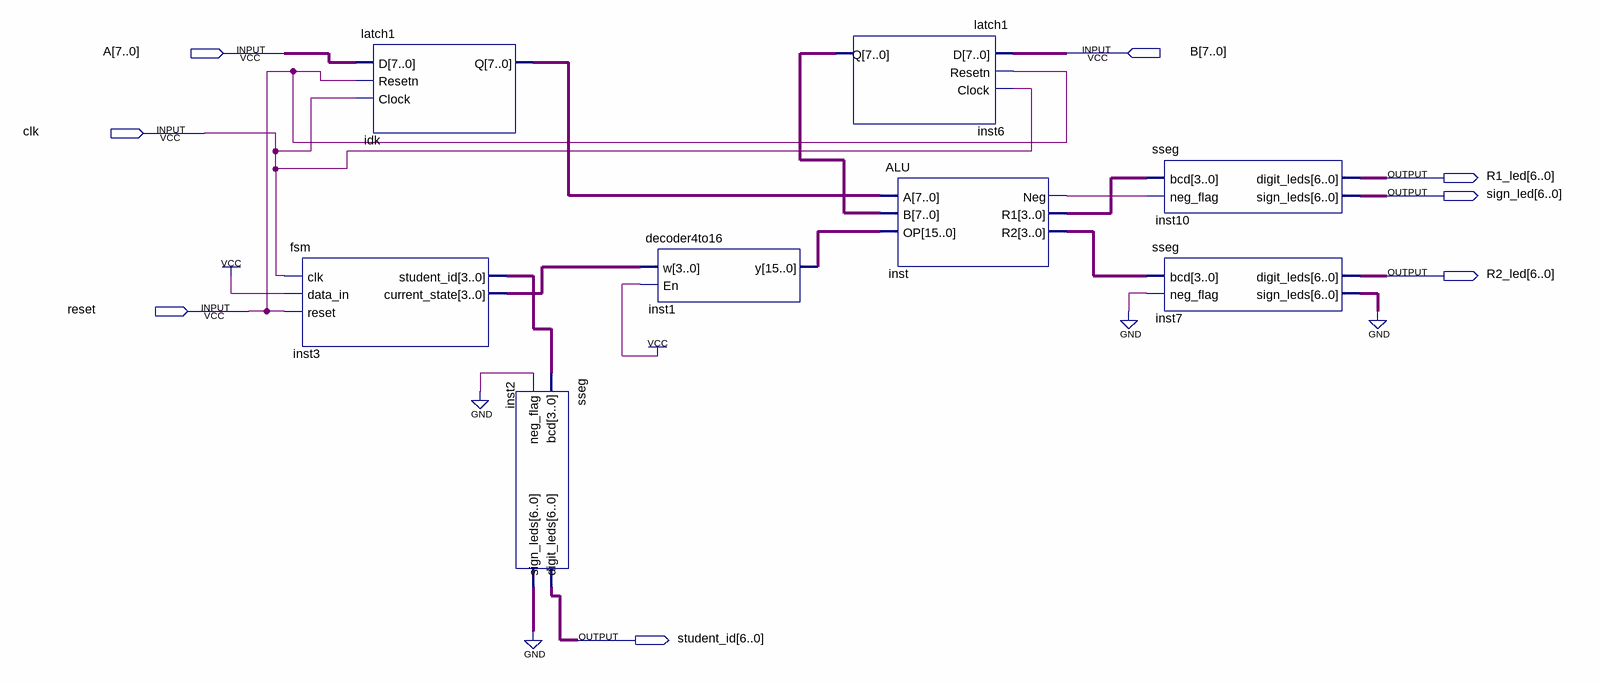
[diagram p0: schematic sheet]
// Quartus schematic ALU1BDF.bdf as structural Verilog: 8 symbols, 8 pins
module ALU1BDF (
  input  [7:0] A,
  input  [7:0] B,
  input  clk,
  input  reset,
  output [6:0] R1_led,
  output [6:0] sign_led,
  output [6:0] R2_led,
  output [6:0] student_id
);

  wire inst_neg;
  wire [3:0] inst3_current_state, inst3_student_id, inst_r1, inst_r2;
  wire [6:0] inst2_sign_leds, inst7_sign_leds;
  wire [7:0] idk_q, inst6_q;
  wire [15:0] inst1_y;

  fsm inst3 (
    .clk(clk), .data_in(1'b1), .reset(reset), .student_id(inst3_student_id),
    .current_state(inst3_current_state));
  latch1 idk (.D(A), .Resetn(reset), .Clock(clk), .Q(idk_q));
  sseg inst2 (.bcd(inst3_student_id), .neg_flag(1'b0), .digit_leds(student_id), .sign_leds(inst2_sign_leds));
  decoder4to16 inst1 (.w(inst3_current_state), .En(1'b1), .y(inst1_y));
  latch1 inst6 (.D(B), .Resetn(reset), .Clock(clk), .Q(inst6_q));
  ALU inst (.A(idk_q), .B(inst6_q), .OP(inst1_y), .Neg(inst_neg), .R1(inst_r1), .R2(inst_r2));
  sseg inst10 (.bcd(inst_r1), .neg_flag(inst_neg), .digit_leds(R1_led), .sign_leds(sign_led));
  sseg inst7 (.bcd(inst_r2), .neg_flag(1'b0), .digit_leds(R2_led), .sign_leds(inst7_sign_leds));
  // also tied to GND on the sheet: {inst2_sign_leds[0], inst2_sign_leds[1], inst2_sign_leds[2], inst2_sign_leds[3], inst2_sign_leds[4], inst2_sign_leds[5], inst2_sign_leds[6], inst7_sign_leds[0], inst7_sign_leds[1], inst7_sign_leds[2], inst7_sign_leds[3], inst7_sign_leds[4], inst7_sign_leds[5], inst7_sign_leds[6]}
endmodule
